# Altium schematic sheet Sheet1.SchDoc
size A4; SheetNumber: 1; SheetTotal: 1
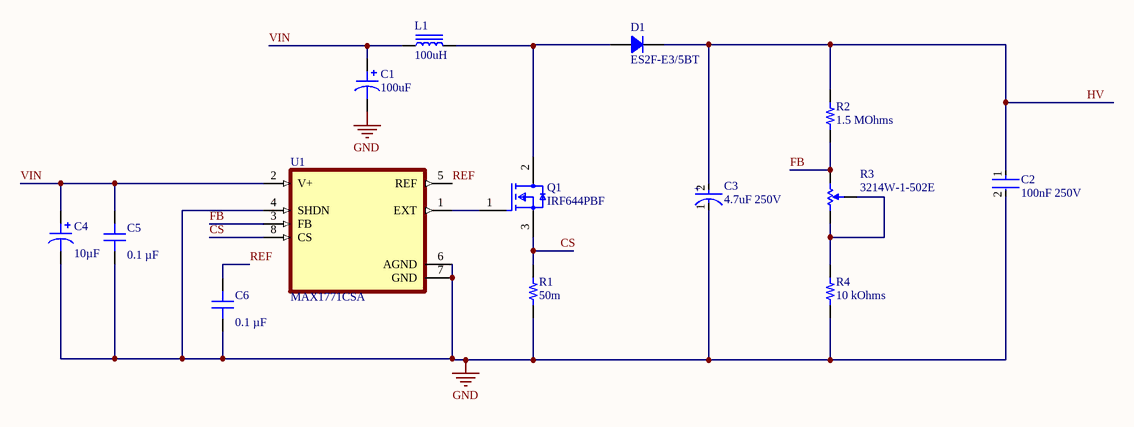
[diagram p0: Sheet1.SchDoc]

## Parts
C1  100uF  [CAP ALSMD 8.3MM H10.5MM]
C2  100nF 250V  [FP-0805-L_2_01_0_2-W_1_25-IPC_B]
C3  4.7uF 250V  [FP-RAD-TH-D_8_0_5-L_11_5-MFG]
C4  10µF  [CAP POL 1206_3216]
C5  0.1 µF  [CAP 0402_1005]
C6  0.1 µF  [CAP 0402_1005]
D1  ES2F-E3/5BT  [DO214AA SMB]
L1  100uH  [BOURNS SRR1280]
Q1  IRF644PBF  [FP-E21-0621-MFG]
R1  50m  [RES 2512_6432]
R2  1.5 MOhms  [RES 1206_3216]
R3  3214W-1-502E  [BOUR-3214W_V]
R4  10 kOhms  [RES 0805_2012]
U1  MAX1771CSA  [SOIC127P600X175-8N]

## Nets
GND: C1.2 C2.2 C3.1(C) C4.2 C5.1 C6.1 R1.1 R4.1 U1.4(SHDN) U1.6(AGND) U1.7(GND)
CS: Q1.3(S) R1.2 U1.8(CS)
FB: R2.1 R3.3 U1.3(FB)
HV: C2.1 C3.2(A) D1.2 R2.2
REF: C6.2 U1.5(REF)
VIN: C1.1 C4.1 C5.2 L1.1 U1.2(V+)
NetD1_1: D1.1 L1.2 Q1.2(D)
NetQ1_1: Q1.1(G) U1.1(EXT)
NetR3_1: R3.1 R3.2 R4.2

## Notes on the sheet
- (in symbol CMP-05427-001567-1) +

## Library data of the parts
C1 = 35SKV100M8X10.5: CAP ALUM 100UF 20% 35V SMD; Part Number: 35SKV100M8X10.5
C2 = CMP-1036-02694-3: CGA4J3X7T2E104K125AA; Capacitance: 470pF; Dielectric Material: Ceramic; Insulation Resistance: 100GR; Dissipation Factor: 2.5%; Tolerance: 10%; Dielectric: X7R; Voltage Rating (DC): 200V; Height: 0.94mm; Radiation Hardening: No; REACH SVHC: No SVHC; Mount: Surface Mount; Thickness: 0.037inch; Package Quantity: 1; Case/Package: 0805; Lead Free: Lead Free; Width: 0.049inch; Packaging: Tape and Reel; Min Operating Temperature: -55°C; Case Code (Imperial): 0805; Termination: SMD/SMT; Max Operating Temperature: 125°C; Depth: 1.25mm; Case Code (Metric): 2012; Number of Pins: 2; Voltage: 200V; Length: 2.01mm; Voltage Rating: 200V; RoHS Compliant: Yes
C3 = CMP-05427-001567-1: A759KS475M2EBAE496; Voltage Rating (DC): 200V; Life (Hours): 2000Hour; Lead/Base Style: Straight; Ripple Current: 50mA; Tolerance: 20%; Packaging: Tape and Reel; Termination: Radial; Height: 11.5mm; Lead Pitch: 5mm; Package Quantity: 1000; Voltage Rating: 200V; Series: NHG; Length: 11.5mm; Mount: Through Hole; Min Operating Temperature: -25°C; Max Operating Temperature: 105°C; RoHS Compliant: Yes; Diameter: 8mm; Case/Package: Radial; Radiation Hardening: No; Height - Seated (Max): 0.492inch; Capacitance: 4.7uF
C4 = F951E106MAAAQ2: CAP TANT 10UF 20% 25V 1206; manufacturer: AVX Corporation; Manufacturer Size Code: A; ESR (Equivalent Series Resistance): 2Ohm; Type: Conformal Coated; Part Number: F951E106MAAAQ2; Value: 10µF; Capacitance: 10µF; componentlink1description: Datasheet; componentlink1url: http://datasheets.avx.com/F95.pdf; componentlink2description: DigiKey Link; componentlink2url: http://digikey.com/product-detail/en/avx-corporation/F951E106MAAAQ2/478-8496-1-ND/4005728; Device Package: 1206 (3216 Metric); Features: General Purpose; Height - Seated (Max): 0.063" (1.60mm); lastupdated: 02.09.2020 01:15:59; Lifecycle Status: Active; Minimum Order: 1; Mounting Type: Surface Mount; Operating Temperature: -55°C ~ 125°C; Package / Case: 1206 (3216 Metric); packaging: TapeAndReel; partid: 173; Part Status: Active; price: 0.28; series: F95, Frameless™; Size / Dimension: 0.126" L x 0.067" W (3.20mm x 1.70mm); Supplier 1: DigiKey; Supplier Part Number 1: 478-8496-1-ND; Tolerance: ±20%; Voltage - Rated: 25V
C5 C6 = CGA2B3X7R1V104M050BB: CAP CER 0.1UF 35V X7R 0402; Part Number: CGA2B3X7R1V104M050BB; Value: 0.1 µF
D1 = ES2F-E3/5BT: DIODE GEN PURP 300V 2A DO214AA; Part Number: ES2F-E3/5BT
L1 = SRR1280-101M: FIXED IND 100UH 2.1A 150MOHM SMD; Part Number: SRR1280-101M
Q1 = CMP-02550-000289-1: N-MOSFET; unipolarny; 250V; 8,5A; 125W; TO220AB; Element Configuration: Single; Current Rating: 4.5A; Max Power Dissipation: 74W; Drain to Source Voltage (Vdss): 500V; Input Capacitance: 610pF; Fall Time: 16ns; On-State Resistance: 1.5R; Recovery Time: 640ns; Polarization: N; Polarity: N-CHANNEL; Number of Channels: 1; Turn-Off Delay Time: 42ns; Threshold Voltage: 4V; Gate to Source Voltage (Vgs): 20V; Turn-On Delay Time: 8.2ns; Min Operating Temperature: -55°C; Case/Package: TO-220AB; Weight: 0.211644oz; Mount: Through Hole; Drain-source On Resistance-Max: 1.5R; Width: 4.7mm; Voltage Rating (DC): 500V; Length: 10.41mm; Contact Plating: Tin; Max Operating Temperature: 150°C; Height: 9.01mm; Continuous Drain Current (ID): 4.5A; Drain to Source Breakdown Voltage: 500V; Number of Pins: 3; Radiation Hardening: No; Drain to Source Resistance: 1.5R; Power Dissipation: 74W; Number of Elements: 1; Package Quantity: 50; Packaging: Rail/Tube; Rds On Max: 1.5R; RoHS Compliant: Yes; Rise Time: 16ns; Lead Free: Lead Free; Nominal Vgs: 4V
R1 = UR73D3ATTE50L0F: RES 50M OHM 1% 1W 2512; Part Number: UR73D3ATTE50L0F
R2 = CRCW12061M50JNEA: ESR18EZPF1504; Manufacturer: Vishay Dale; Power (Watts): 0.25W, 1/4W; Temperature Coefficient: ±200ppm/°C; Tolerance: ±5%; Part Number: CRCW12061M50JNEA; ComponentLink1Description: Datasheet; ComponentLink1URL: http://www.vishay.com/docs/20035/dcrcwe3.pdf; ComponentLink2Description: DigiKey Link; ComponentLink2URL: http://digikey.com/product-detail/en/vishay-dale/CRCW12061M50JNEA/541-1.5MECT-ND/1181391; Composition: Thick Film; Device Package: 1206 (3216 Metric); Features: Automotive AEC-Q200; Height - Seated (Max): 0.024" (0.60mm); LastUpdated: 27.02.2023 20:36:38; Lifecycle Status: Active; Minimum Order: 1; Number of Terminations: 2; Operating Temperature: -55°C ~ 155°C; Package / Case: 1206 (3216 Metric); Packaging: TapeAndReel; PartId: 27543; Part Status: Active; Price: 0.01; Ratings: AEC-Q200; Resistance: 1.5 MOhms; Series: CRCW; Size / Dimension: 0.126" L x 0.063" W (3.20mm x 1.60mm); Supplier 1: DigiKey; Supplier Part Number 1: 541-1.5MECT-ND; Supplier Device Package: 1206; Value: 1.5 MOhms
R3 = CMP-2000-05579-1: 3214 - 5-Turn Trimpot(R) Trimming Potentiometer, 5 KOhm, +/- 10%, 0.25 W, -65 to 150 degC, RoHS, Tape and Reel; Manufacturer: Bourns; Temperature Coefficient: ±100ppm/°C; Power Rating: 250mW; No. of Turns: 5; Track Resistance: 5kohm; SVHC: NoSVHC(16-Jun-2014); Potentiometer Mounting: SMD; Manufacturer URL: http://www.bourns.com/; Resistance Tolerance: ±10%; Datasheet URL: http://www.bourns.com/docs/Product-Datasheets/3214.pdf; ROHS COMPLIANT: Yes; Mounting Technology: SurfaceMount; Datasheet Version: 05/2016; Package Reference: 3214W; Package Description: 3-Pin Surface Mount Device, Body 3.5 x 4.8 mm, Pitch 1.25 mm
R4 = CPF0805B10KE: RES SMD 10K OHM 0.1% 1/10W 0805; Manufacturer: TE Connectivity Passive Product; Power (Watts): 0.1W, 1/10W; Temperature Coefficient: ±25ppm/°C; Part Number: CPF0805B10KE; Value: 10 kOhms; ComponentLink1Description: Datasheet; ComponentLink1URL: https://www.te.com/commerce/DocumentDelivery/DDEController?Action=srchrtrv&DocNm=1773200&DocType=DS&DocLang=English; ComponentLink2Description: DigiKey Link; ComponentLink2URL: https://www.digikey.com/en/products/detail/te-connectivity-passive-product/CPF0805B10KE/2389790; Composition: Thin Film; Device Package: 0805 (2012 Metric); Height - Seated (Max): 0.026" (0.65mm); LastUpdated: 27.02.2023 20:43:05; Lifecycle Status: Active; Minimum Order: 1; Number of Terminations: 2; Operating Temperature: -55°C ~ 155°C; Package / Case: 0805 (2012 Metric); Packaging: TapeAndReel; PartId: 27724; Part Status: Active; Price: 0.10; Resistance: 10 kOhms; Series: CPF, Neohm; Size / Dimension: 0.079" L x 0.049" W (2.00mm x 1.25mm); Supplier 1: DigiKey; Supplier Part Number 1: A106043CT-ND; Supplier Device Package: 0805; Tolerance: ±0.1%
U1 = MAX1771CSA: Boost, Buck-Boost Regulator Positive Output Step-Up, Step-Up/Step-Down - DC-DC Controller IC 8-SOIC; MF: Maxim Integrated; Price: None; MP: MAX1771CSA; Purchase-URL: https://pricing.snapeda.com/search/part/MAX1771CSA/?ref=eda; Package: SOIC-8 Maxim; Check_prices: https://www.snapeda.com/parts/MAX1771CSA/Maxim+Integrated/view-part/?ref=eda; SnapEDA_Link: https://www.snapeda.com/parts/MAX1771CSA/Maxim+Integrated/view-part/?ref=snap; Availability: In Stock; Value: *